# Altium project mcontroller.PrjPcb
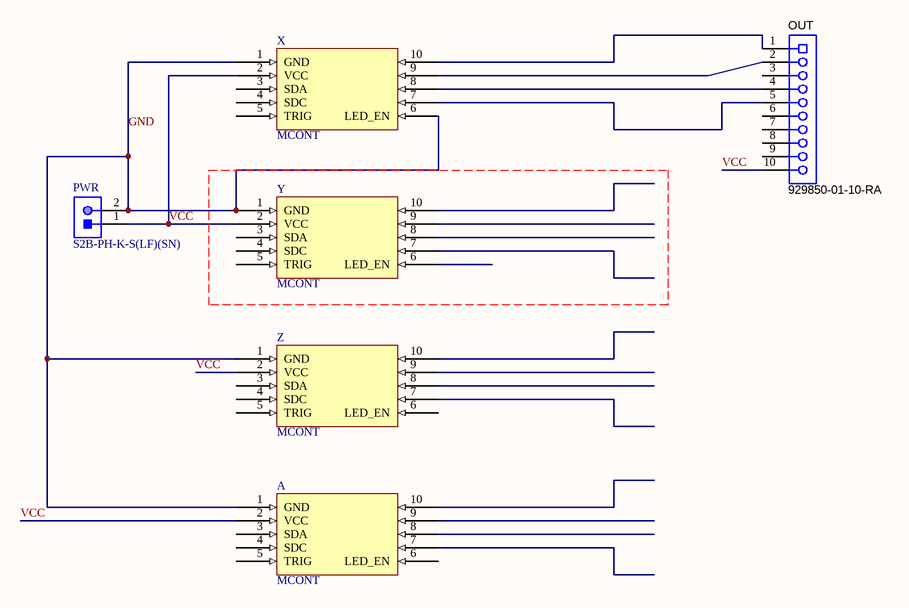
[diagram p0: main.SchDoc]
pinmod: 24
1 sheet, 6 parts. Net scope: global (net labels, ports and power ports of the same name join across sheets).
Board file: full_routing.PcbDoc

## Sheet main.SchDoc
size A; SheetNumber: 1; SheetTotal: 1

### Parts
A  MCONT  [MCONT]
OUT  929850-01-10-RA  [3M-929850-01-10-RA_V]
PWR  S2B-PH-K-S(LF)(SN)  [JST-S2B-PH-K-S_V]
X  MCONT  [MCONT]
Y  MCONT  [MCONT]
Z  MCONT  [MCONT]

### Nets
GND: A.1(GND) PWR.2 X.1(GND) X.6(LED_EN) Y.1(GND) Z.1(GND)
VCC: A.2(VCC) OUT.10 PWR.1 X.2(VCC) Y.2(VCC) Z.2(VCC)
NetOUT_1: OUT.1 X.10
NetOUT_2: OUT.2 X.9
NetOUT_4: OUT.4 X.8
NetOUT_5: OUT.5 X.7

Not connected (* = marked no-connect by the designer): A 3(SDA) 4(SDC) 5(TRIG) 6(LED_EN) 7 8 9 10; OUT 3 6 7 8 9; X 3(SDA) 4(SDC) 5(TRIG); Y 3(SDA) 4(SDC) 5(TRIG) 6(LED_EN) 7 8 9 10; Z 3(SDA) 4(SDC) 5(TRIG) 6(LED_EN) 7 8 9 10

### Library data of the parts
OUT = CMP-002-00023-2: Female Header, Pitch 2.54 mm, 1 x 10 Position, Height 8.26 mm, Tail Length 3.18 mm, -40 to 105 degC, RoHS, Bulk; Manufacturer: 3M; Current Rating: 1A; Datasheet Version: Jun-13; Contact Finish: Gold; Package Description: Female Header, Pitch 2.54 mm, 1 x 10 Position, Height 8.26 mm, Tail Length 3.18 mm; Mounting Technology: TH; Max Operating Temperature: 105°C; Pins: 10; Lead Pitch: 2.54mm; RoHS Compliant: True; Contact Plating: Gold; Min Operating Temperature: -40°C; Colour: Black; Contact Gender: Female; Package Reference: 929850-01-10-RA; Gender: Female; Case/Package: 929850-01-10-RA; Packaging: Bulk; Package Quantity: 300; Datasheet URL: http://multimedia.3m.com/mws/media/22500O/3mtm-boardmount-skt-100-100x-100strt-sldr-tails-ts0815.pdf; Connector Type: Header; Contact Material: Copper; Manufacturer URL: http://www.3m.com/
PWR = CMP-002-00030-2: Male Header, Pitch 2 mm, 1 x 2 Position, Height 4.8 mm, Tail Length 3.4 mm, -25 to 85 degC, RoHS, Bulk; Manufacturer: Japan Solderless Terminals; Package Reference: S2B-PH-K-S; Case/Package: S2B-PH-K-S; Datasheet URL: http://www.jst-mfg.com/product/pdf/eng/ePH.pdf; RoHS Compliant: Unknown; Datasheet Version: Dec-12; Gender: Male; Min Operating Temperature: -25°C; Max Operating Temperature: 85°C; Package Description: Male Header, Pitch 2 mm, 1 x 2 Position, Height 4.8 mm, Tail Length 3.4 mm; Connector Type: Header; Mounting Technology: SM